# Altium schematic sheet Master Micro Controller.SchDoc: Main Micro Controller
size 292 x 193 mm; SheetNumber: 9; SheetTotal: 28
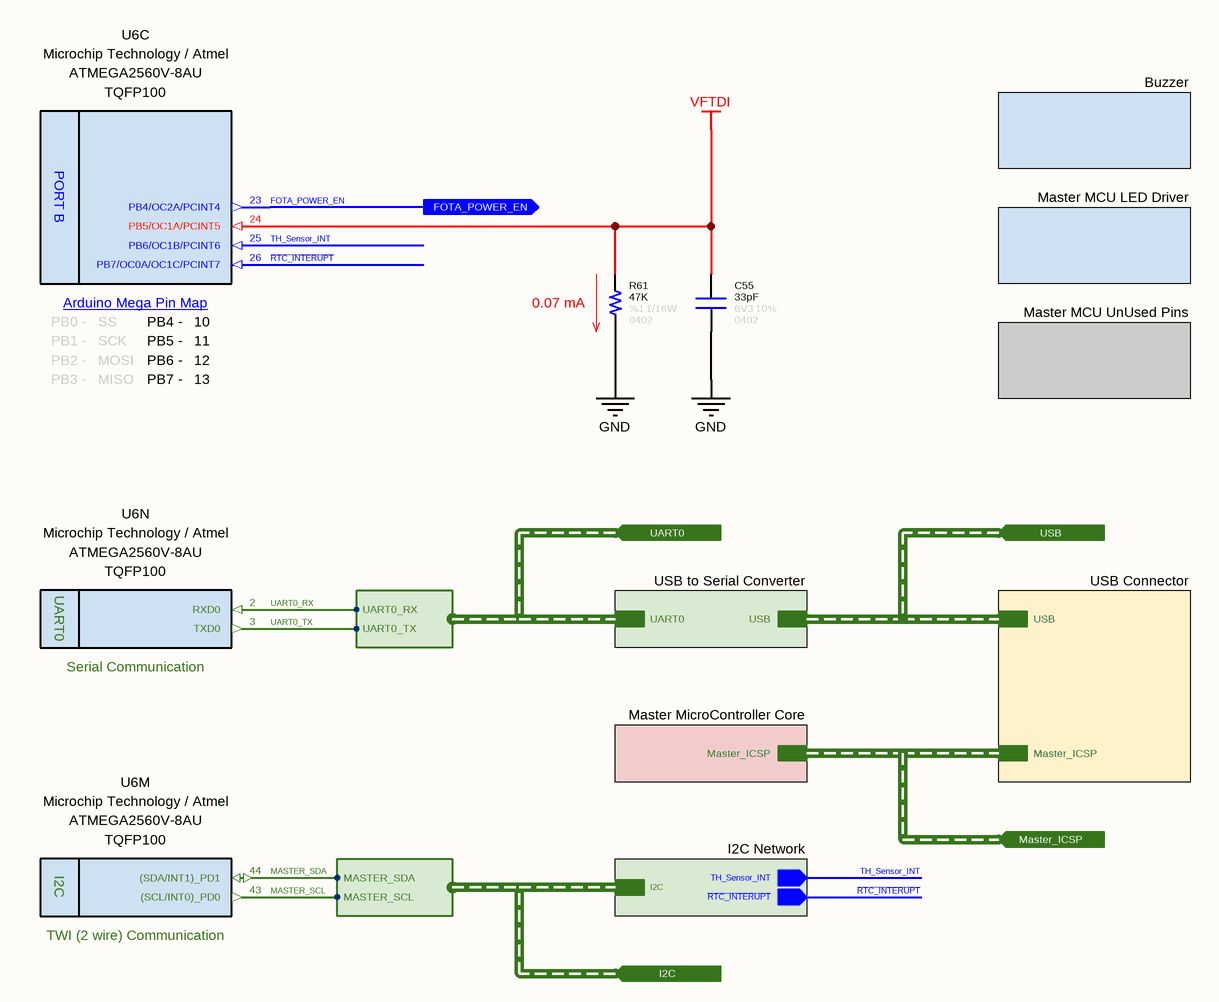
[diagram p0: Master Micro Controller.SchDoc]

## Parts
C55  value 33pF  Tolerance: 10%  Case: 0402  Voltage: 6V3  [CAPACITOR_0402]  (hidden comment: Capacitor - 33pF [0402] (Ceramic))
R61  value 47K  Tolerance: %1  Case: 0402  Power: 1/16W  [RESISTOR_0402]  (hidden comment: 47K - 0402 - %1 - 1/16W)
U6  Manufacturer Name: Microchip Technology / Atmel  Case: TQFP100  [TQFP-100]  (hidden comment: ATMEGA2560V-8AU)  (parts C,M,N of 16)

## Sub-sheets
Buzzer = Buzzer.SchDoc: no entries
I2C Network = I2C Block Diagram.SchDoc: I2C (harness I2C), TH_Sensor_INT (out), ~{RTC_INTERUPT} (out)
Master MCU LED Driver = Master MicroController LED Driver.SchDoc: no entries
Master MCU UnUsed Pins = UnUsed MicroController Pins.SchDoc: no entries
Master MicroController Core = Master Micro Controller Core.SchDoc: Master_ICSP (harness Master_ICSP)
USB Connector = USB Connector.SchDoc: USB (harness USB), Master_ICSP (harness Master_ICSP)
USB to Serial Converter = Serial to USB Converter.SchDoc: USB (harness USB), UART0 (harness UART0)

## Ports
FOTA_POWER_EN (out), I2C (in, harness I2C), Master_ICSP (in, harness Master_ICSP), UART0 (in, harness UART0), USB (in, harness USB)

## Harnesses
UART0: UART0_RX, UART0_TX
I2C: MASTER_SDA, MASTER_SCL

## Nets
GND: C55.1 R61.1
VFTDI: C55.2 R61.2 U6.24(PB5/OC1A/PCINT5)
FOTA_POWER_EN: U6.23(PB4/OC2A/PCINT4) ; port FOTA_POWER_EN
MASTER_SCL: U6.43((SCL/INT0)_PD0) ; port I2C.MASTER_SCL
MASTER_SDA: U6.44((SDA/INT1)_PD1) ; port I2C.MASTER_SDA
~{RTC_INTERUPT}: U6.26(PB7/OC0A/OC1C/PCINT7) ; sheet I2C Network/~{RTC_INTERUPT}
TH_Sensor_INT: U6.25(PB6/OC1B/PCINT6) ; sheet I2C Network/TH_Sensor_INT
UART0_RX: U6.2(RXD0) ; port UART0.UART0_RX
UART0_TX: U6.3(TXD0) ; port UART0.UART0_TX

## Buses and harness runs
harness port I2C = sheet I2C Network/I2C
harness port Master_ICSP = sheet Master MicroController Core/Master_ICSP = sheet USB Connector/Master_ICSP
harness port UART0 = sheet USB to Serial Converter/UART0
harness port USB = sheet USB Connector/USB = sheet USB to Serial Converter/USB

## Notes on the sheet
- (near R61) 0.07 mA
- © 2021 All rights reserved.
  This document may not, in whole or in part, be copied, photocopied, reproduced, translated or converted to any electronic or machine readable from without prior written permission of Mehmet Günce Akkoyun.
  Engineer contact : akkoyun@me.com
- Property of
- Engineer :
- Date :
- Size :
- A4
- Time :
- Project :
- Page :
- /
- Customer :
- Product ID :
- Module ID :
- Version :
- File :
- Revision :
- (in symbol IC - AtMega2560V-8AU, part C) PORT B; Arduino Mega Pin Map; PB0 -; SS; PB4 -; PB1 -; SCK; PB5 -; PB2 -; MOSI; PB6 -; PB3 -; MISO; PB7 -
- (in symbol IC - AtMega2560V-8AU, part M) I2C; TWI (2 wire) Communication
- (in symbol IC - AtMega2560V-8AU, part N) UART0; Serial Communication

## Library data of the parts
C55 = Capacitor - 33pF [0402-6V3]: Manufacturer Name: Kemet; Manufacturer Part Number: C0402C330J9RACAUTO; ComponentLink1Description: DataSheet; ComponentLink1URL: https://api.kemet.com/component-edge/download/datasheet/C0402C330J9RACAUTO.pdf; ComponentLink2Description: Mouser; ComponentLink2URL: https://www.mouser.com/Search/Refine.aspx?Keyword=80-C0402C330J9RAUTO
R61 = Resistor - 47K [0402]: Thick Film Resistors - SMD 1/16 W 47 KOhm 1%; Manufacturer Name: Vishay; Manufacturer Part Number: CRCW040247K0FKED; ComponentLink1Description: DataSheet; ComponentLink1URL: https://www.mouser.com.tr/datasheet/2/427/dcrcwe3-1762152.pdf; ComponentLink2Description: Mouser; ComponentLink2URL: https://www.mouser.com.tr/ProductDetail/Vishay-Dale/CRCW040247K0FKED?qs=sGAEpiMZZMu61qfTUdNhG2DpbjADlD3GL%252B3h1elTxqU%3D
U6 = IC - AtMega2560V-8AU: ATmega Series 256 KB Flash 8 KB SRAM 8 MHz 8-Bit Microcontroller - TQFP-100; Program Memory Size: 256 kB; Core: AVR; Operating Supply Voltage: 2.7 V to 5.5 V; Maximum Clock Frequency: 8 MHz; Maximum Operating Temperature: + 85 C; Product Type: MicroControllers; Minimum Operating Temperature: - 40 C; Manufacturer Part Number: ATMEGA2560V-8AU